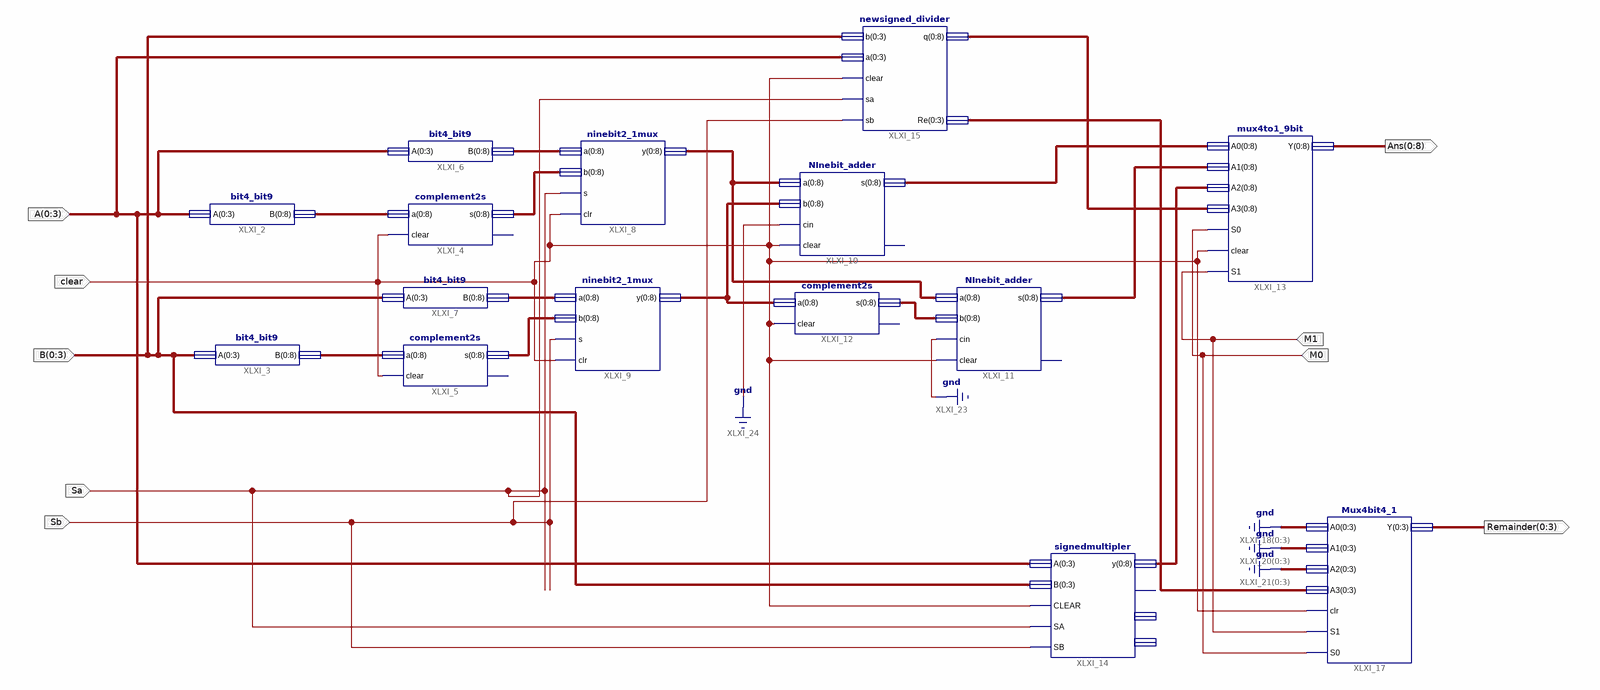
[diagram p0: schematic sheet 1]
// Xilinx ISE schematic s_calculator.sch (artix7) as structural Verilog: 15 symbols, 9 ports
module s_calculator (
  input  Sb,
  input  Sa,
  input  M0,
  input  M1,
  input  clear,
  input  [0:3] A,
  input  [0:3] B,
  output [0:3] Remainder,
  output [0:8] Ans
);

  wire [3:0] XLXN_32;
  wire [8:0] XLXN_4, XLXN_5, XLXN_9, XLXN_10, XLXN_11, XLXN_12, XLXN_13, XLXN_15, XLXN_18, XLXN_19, XLXN_20,
       XLXN_23, XLXN_28;

  bit4_bit9 XLXI_2 (
    .A(A),
    .B({XLXN_4[0], XLXN_4[1], XLXN_4[2], XLXN_4[3], XLXN_4[4], XLXN_4[5], XLXN_4[6], XLXN_4[7], XLXN_4[8]}));
  bit4_bit9 XLXI_3 (
    .A(B),
    .B({XLXN_5[0], XLXN_5[1], XLXN_5[2], XLXN_5[3], XLXN_5[4], XLXN_5[5], XLXN_5[6], XLXN_5[7], XLXN_5[8]}));
  complement2s XLXI_4 (
    .a({XLXN_4[0], XLXN_4[1], XLXN_4[2], XLXN_4[3], XLXN_4[4], XLXN_4[5], XLXN_4[6], XLXN_4[7], XLXN_4[8]}),
    .clear(clear),
    .s({XLXN_10[0], XLXN_10[1], XLXN_10[2], XLXN_10[3], XLXN_10[4], XLXN_10[5], XLXN_10[6], XLXN_10[7], XLXN_10[8]}));  // open: cout
  complement2s XLXI_5 (
    .a({XLXN_5[0], XLXN_5[1], XLXN_5[2], XLXN_5[3], XLXN_5[4], XLXN_5[5], XLXN_5[6], XLXN_5[7], XLXN_5[8]}),
    .clear(clear),
    .s({XLXN_12[0], XLXN_12[1], XLXN_12[2], XLXN_12[3], XLXN_12[4], XLXN_12[5], XLXN_12[6], XLXN_12[7], XLXN_12[8]}));  // open: cout
  bit4_bit9 XLXI_6 (
    .A(A),
    .B({XLXN_9[0], XLXN_9[1], XLXN_9[2], XLXN_9[3], XLXN_9[4], XLXN_9[5], XLXN_9[6], XLXN_9[7], XLXN_9[8]}));
  bit4_bit9 XLXI_7 (
    .A(B),
    .B({XLXN_11[0], XLXN_11[1], XLXN_11[2], XLXN_11[3], XLXN_11[4], XLXN_11[5], XLXN_11[6], XLXN_11[7], XLXN_11[8]}));
  ninebit2_1mux XLXI_8 (
    .a({XLXN_9[0], XLXN_9[1], XLXN_9[2], XLXN_9[3], XLXN_9[4], XLXN_9[5], XLXN_9[6], XLXN_9[7], XLXN_9[8]}),
    .b({XLXN_10[0], XLXN_10[1], XLXN_10[2], XLXN_10[3], XLXN_10[4], XLXN_10[5], XLXN_10[6], XLXN_10[7], XLXN_10[8]}),
    .s(Sa), .clr(clear),
    .y({XLXN_13[0], XLXN_13[1], XLXN_13[2], XLXN_13[3], XLXN_13[4], XLXN_13[5], XLXN_13[6], XLXN_13[7], XLXN_13[8]}));
  ninebit2_1mux XLXI_9 (
    .a({XLXN_11[0], XLXN_11[1], XLXN_11[2], XLXN_11[3], XLXN_11[4], XLXN_11[5], XLXN_11[6], XLXN_11[7], XLXN_11[8]}),
    .b({XLXN_12[0], XLXN_12[1], XLXN_12[2], XLXN_12[3], XLXN_12[4], XLXN_12[5], XLXN_12[6], XLXN_12[7], XLXN_12[8]}),
    .s(Sb), .clr(clear),
    .y({XLXN_15[0], XLXN_15[1], XLXN_15[2], XLXN_15[3], XLXN_15[4], XLXN_15[5], XLXN_15[6], XLXN_15[7], XLXN_15[8]}));
  NInebit_adder XLXI_10 (
    .a({XLXN_13[0], XLXN_13[1], XLXN_13[2], XLXN_13[3], XLXN_13[4], XLXN_13[5], XLXN_13[6], XLXN_13[7], XLXN_13[8]}),
    .b({XLXN_15[0], XLXN_15[1], XLXN_15[2], XLXN_15[3], XLXN_15[4], XLXN_15[5], XLXN_15[6], XLXN_15[7], XLXN_15[8]}),
    .cin(1'b0), .clear(clear),
    .s({XLXN_19[0], XLXN_19[1], XLXN_19[2], XLXN_19[3], XLXN_19[4], XLXN_19[5], XLXN_19[6], XLXN_19[7], XLXN_19[8]}));  // open: cout
  NInebit_adder XLXI_11 (
    .a({XLXN_13[0], XLXN_13[1], XLXN_13[2], XLXN_13[3], XLXN_13[4], XLXN_13[5], XLXN_13[6], XLXN_13[7], XLXN_13[8]}),
    .b({XLXN_18[0], XLXN_18[1], XLXN_18[2], XLXN_18[3], XLXN_18[4], XLXN_18[5], XLXN_18[6], XLXN_18[7], XLXN_18[8]}),
    .cin(1'b0), .clear(clear),
    .s({XLXN_20[0], XLXN_20[1], XLXN_20[2], XLXN_20[3], XLXN_20[4], XLXN_20[5], XLXN_20[6], XLXN_20[7], XLXN_20[8]}));  // open: cout
  complement2s XLXI_12 (
    .a({XLXN_15[0], XLXN_15[1], XLXN_15[2], XLXN_15[3], XLXN_15[4], XLXN_15[5], XLXN_15[6], XLXN_15[7], XLXN_15[8]}),
    .clear(clear),
    .s({XLXN_18[0], XLXN_18[1], XLXN_18[2], XLXN_18[3], XLXN_18[4], XLXN_18[5], XLXN_18[6], XLXN_18[7], XLXN_18[8]}));  // open: cout
  mux4to1_9bit XLXI_13 (
    .A0({XLXN_19[0], XLXN_19[1], XLXN_19[2], XLXN_19[3], XLXN_19[4], XLXN_19[5], XLXN_19[6], XLXN_19[7], XLXN_19[8]}),
    .A1({XLXN_20[0], XLXN_20[1], XLXN_20[2], XLXN_20[3], XLXN_20[4], XLXN_20[5], XLXN_20[6], XLXN_20[7], XLXN_20[8]}),
    .A2({XLXN_28[0], XLXN_28[1], XLXN_28[2], XLXN_28[3], XLXN_28[4], XLXN_28[5], XLXN_28[6], XLXN_28[7], XLXN_28[8]}),
    .A3({XLXN_23[0], XLXN_23[1], XLXN_23[2], XLXN_23[3], XLXN_23[4], XLXN_23[5], XLXN_23[6], XLXN_23[7], XLXN_23[8]}),
    .S0(M0), .clear(clear), .S1(M1), .Y(Ans));
  signedmultipler XLXI_14 (
    .A(A), .B(B), .CLEAR(clear), .SA(Sa), .SB(Sb),
    .y({XLXN_28[0], XLXN_28[1], XLXN_28[2], XLXN_28[3], XLXN_28[4], XLXN_28[5], XLXN_28[6], XLXN_28[7], XLXN_28[8]}));  // open: cout, M, s
  newsigned_divider XLXI_15 (
    .b(B), .a(A), .clear(clear), .sa(Sa), .sb(Sb),
    .q({XLXN_23[0], XLXN_23[1], XLXN_23[2], XLXN_23[3], XLXN_23[4], XLXN_23[5], XLXN_23[6], XLXN_23[7], XLXN_23[8]}),
    .Re({XLXN_32[0], XLXN_32[1], XLXN_32[2], XLXN_32[3]}));
  Mux4bit4_1 XLXI_17 (
    .A0(4'b0000), .A1(4'b0000), .A2(4'b0000), .A3({XLXN_32[0], XLXN_32[1], XLXN_32[2], XLXN_32[3]}),
    .clr(clear), .S1(M1), .S0(M0), .Y(Remainder));
endmodule
